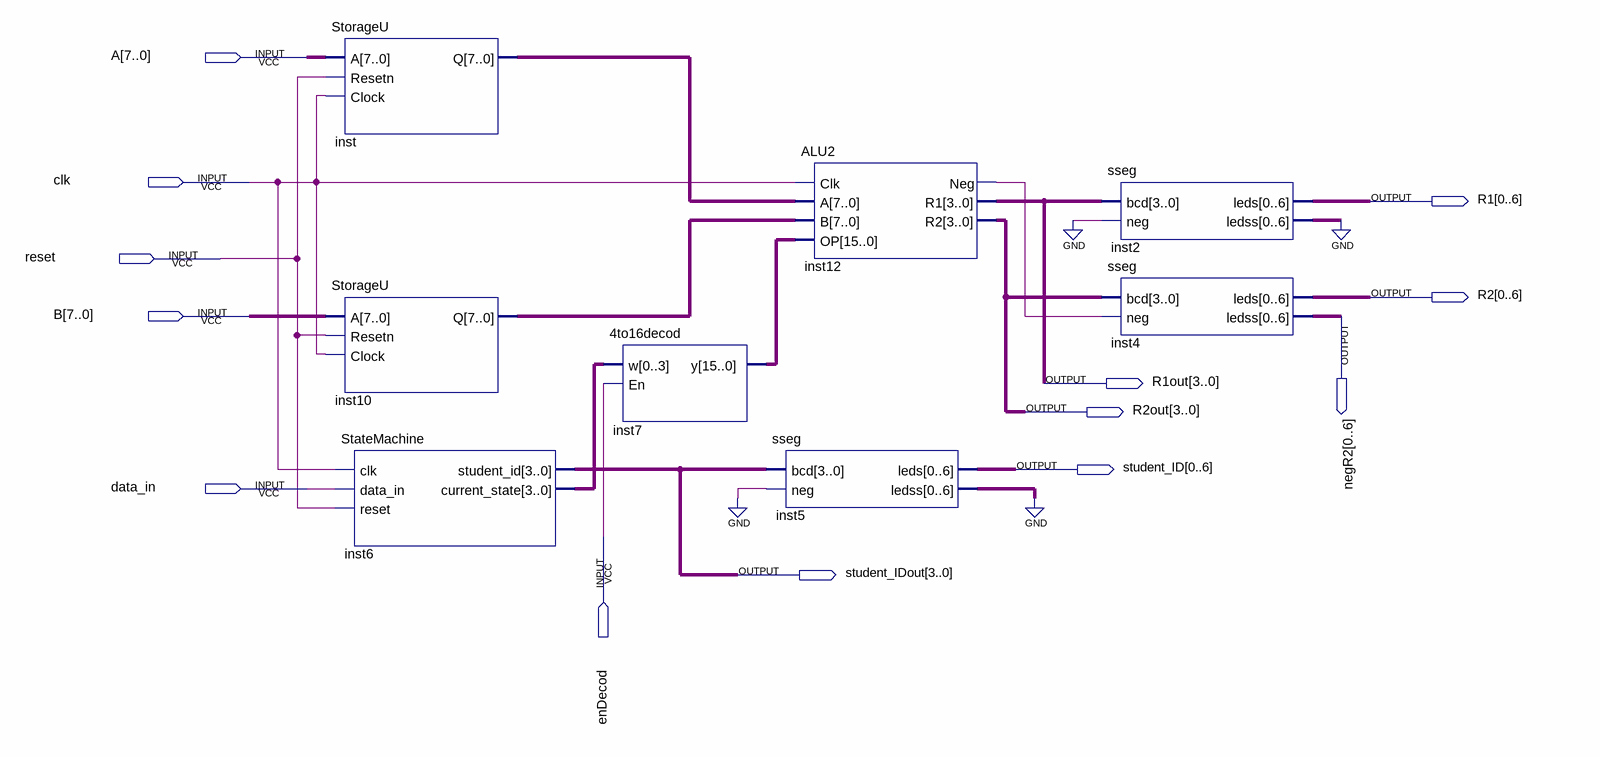
[diagram p0: schematic sheet]
// Quartus schematic GPUblock2.bdf as structural Verilog: 8 symbols, 13 pins
module GPUblock2 (
  input  [7:0] A,
  input  clk,
  input  reset,
  input  [7:0] B,
  input  data_in,
  input  enDecod,
  output [0:6] R1,
  output [0:6] R2,
  output [0:6] negR2,
  output [3:0] R1out,
  output [3:0] R2out,
  output [0:6] student_ID,
  output [3:0] student_IDout
);

  wire inst12_neg;
  wire [3:0] inst6_current_state;
  wire [6:0] inst2_ledss, inst5_ledss;
  wire [7:0] inst10_q, inst_q;
  wire [15:0] inst7_y;

  StorageU inst (.A(A), .Resetn(reset), .Clock(clk), .Q(inst_q));
  StorageU inst10 (.A(B), .Resetn(reset), .Clock(clk), .Q(inst10_q));
  StateMachine inst6 (
    .clk(clk), .data_in(data_in), .reset(reset), .student_id(student_IDout),
    .current_state(inst6_current_state));
  \4to16decod  inst7 (.w(inst6_current_state), .En(enDecod), .y(inst7_y));
  sseg inst5 (.bcd(student_IDout), .neg(1'b0), .leds(student_ID), .ledss(inst5_ledss));
  ALU2 inst12 (.Clk(clk), .A(inst_q), .B(inst10_q), .OP(inst7_y), .Neg(inst12_neg), .R1(R1out), .R2(R2out));
  sseg inst2 (.bcd(R1out), .neg(1'b0), .leds(R1), .ledss(inst2_ledss));
  sseg inst4 (.bcd(R2out), .neg(inst12_neg), .leds(R2), .ledss(negR2));
  // also tied to GND on the sheet: {inst2_ledss[0], inst2_ledss[1], inst2_ledss[2], inst2_ledss[3], inst2_ledss[4], inst2_ledss[5], inst2_ledss[6], inst5_ledss[0], inst5_ledss[1], inst5_ledss[2], inst5_ledss[3], inst5_ledss[4], inst5_ledss[5], inst5_ledss[6]}
endmodule
